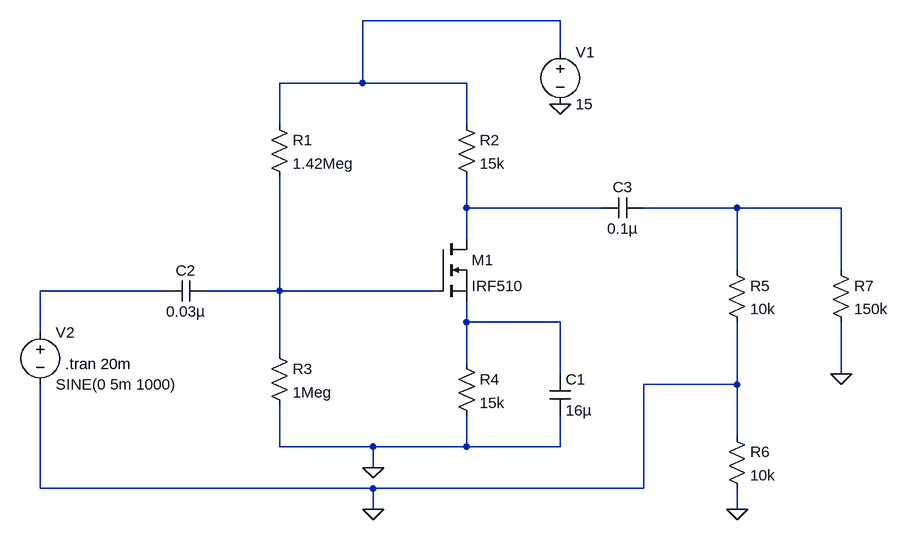
[diagram p0: schematic VOLTAGE SERIES FEEDBACK MOSFET AMPLIFIER.asc]
VOLTAGE SERIES FEEDBACK MOSFET AMPLIFIER.asc, the LTspice schematic file:
Version 4
SHEET 1 960 680
WIRE 448 -192 144 -192
WIRE 448 -144 448 -192
WIRE 144 -96 144 -192
WIRE 144 -96 16 -96
WIRE 304 -96 144 -96
WIRE 16 -32 16 -96
WIRE 304 -32 304 -96
WIRE 304 96 304 48
WIRE 512 96 304 96
WIRE 720 96 576 96
WIRE 880 96 720 96
WIRE 304 144 304 96
WIRE 720 192 720 96
WIRE 880 192 880 96
WIRE -160 224 -352 224
WIRE 16 224 16 48
WIRE 16 224 -96 224
WIRE 256 224 16 224
WIRE 304 272 304 240
WIRE 448 272 304 272
WIRE -352 288 -352 224
WIRE 16 320 16 224
WIRE 304 336 304 272
WIRE 448 352 448 272
WIRE 880 352 880 272
WIRE 720 368 720 272
WIRE 720 368 576 368
WIRE 720 448 720 368
WIRE 16 464 16 400
WIRE 160 464 16 464
WIRE 304 464 304 416
WIRE 304 464 160 464
WIRE 448 464 448 416
WIRE 448 464 304 464
WIRE 160 496 160 464
WIRE -352 528 -352 368
WIRE 160 528 -352 528
WIRE 576 528 576 368
WIRE 576 528 160 528
WIRE 160 560 160 528
WIRE 720 560 720 528
FLAG 160 496 0
FLAG 448 -64 0
FLAG 720 560 0
FLAG 880 352 0
FLAG 160 560 0
SYMBOL res 0 -48 R0
SYMATTR InstName R1
SYMATTR Value 1.42Meg
SYMBOL res 288 -48 R0
SYMATTR InstName R2
SYMATTR Value 15k
SYMBOL res 0 304 R0
SYMATTR InstName R3
SYMATTR Value 1Meg
SYMBOL res 288 320 R0
SYMATTR InstName R4
SYMATTR Value 15k
SYMBOL nmos 256 144 R0
SYMATTR InstName M1
SYMATTR Value IRF510
SYMBOL cap 432 352 R0
SYMATTR InstName C1
SYMATTR Value 16µ
SYMBOL cap -96 208 R90
WINDOW 0 0 32 VBottom 2
WINDOW 3 32 32 VTop 2
SYMATTR InstName C2
SYMATTR Value 0.03µ
SYMBOL cap 576 80 R90
WINDOW 0 0 32 VBottom 2
WINDOW 3 32 32 VTop 2
SYMATTR InstName C3
SYMATTR Value 0.1µ
SYMBOL voltage 448 -160 R0
WINDOW 123 0 0 Left 0
WINDOW 39 0 0 Left 0
SYMATTR InstName V1
SYMATTR Value 15
SYMBOL voltage -352 272 R0
WINDOW 123 32 71 Left 2
WINDOW 39 0 0 Left 0
SYMATTR InstName V2
SYMATTR Value SINE(0 5m 1000)
SYMBOL res 704 176 R0
SYMATTR InstName R5
SYMATTR Value 10k
SYMBOL res 704 432 R0
SYMATTR InstName R6
SYMATTR Value 10k
SYMBOL res 864 176 R0
SYMATTR InstName R7
SYMATTR Value 150k
TEXT -314 336 Left 2 !.tran 20m

The netlist it stands for:
* VOLTAGE SERIES FEEDBACK MOSFET AMPLIFIER.asc
R1 N001 N005 1.42Meg
R2 N001 N002 15k
R3 N005 0 1Meg
R4 N006 0 15k
M1 N002 N005 N006 N006 IRF510
C1 N006 0 16µ
C2 N005 N004 0.03µ
C3 N003 N002 0.1µ
V1 N001 0 15
V2 N004 0 SINE(0 5m 1000)
R5 N003 0 10k
R6 0 0 10k
R7 N003 0 150k
.model NMOS NMOS
.model PMOS PMOS
.lib standard.mos
.tran 20m
.backanno
.end